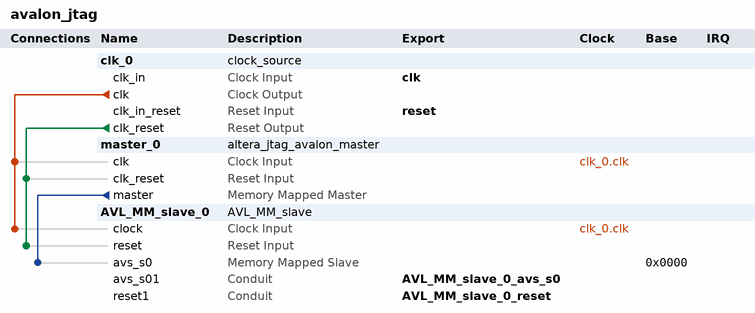
[diagram p0: system contents]
# Platform Designer (Qsys) system avalon_jtag, Cyclone V 5CSEMA5F31C6
# Parameters at their usual value, and those the tool derives, are not listed.
package require -exact qsys 24.1
create_system avalon_jtag
set_project_property DEVICE_FAMILY {Cyclone V}
set_project_property DEVICE 5CSEMA5F31C6

add_instance clk_0 clock_source 24.1
set_instance_parameter_value clk_0 clockFrequency 50000000

add_instance master_0 altera_jtag_avalon_master 24.1

add_instance AVL_MM_slave_0 AVL_MM_slave 1.0

# connections
add_connection clk_0.clk AVL_MM_slave_0.clock clock
add_connection clk_0.clk master_0.clk clock
add_connection clk_0.clk_reset AVL_MM_slave_0.reset reset
add_connection clk_0.clk_reset master_0.clk_reset reset
add_connection master_0.master AVL_MM_slave_0.avs_s0 avalon
set_connection_parameter_value master_0.master/AVL_MM_slave_0.avs_s0 baseAddress 0x0000

# exported interfaces
add_interface AVL_MM_slave_0_avs_s0 conduit end
set_interface_property AVL_MM_slave_0_avs_s0 EXPORT_OF AVL_MM_slave_0.avs_s01
add_interface AVL_MM_slave_0_reset conduit end
set_interface_property AVL_MM_slave_0_reset EXPORT_OF AVL_MM_slave_0.reset1
add_interface clk clock sink
set_interface_property clk EXPORT_OF clk_0.clk_in
add_interface reset reset sink
set_interface_property reset EXPORT_OF clk_0.clk_in_reset

set_interconnect_requirement {$system} qsys_mm.clockCrossingAdapter HANDSHAKE
set_interconnect_requirement {$system} qsys_mm.enableEccProtection FALSE
set_interconnect_requirement {$system} qsys_mm.insertDefaultSlave FALSE
set_interconnect_requirement {$system} qsys_mm.maxAdditionalLatency 1

save_system avalon_jtag.qsys
